# EAGLE design untitled (EAGLE 6.1)
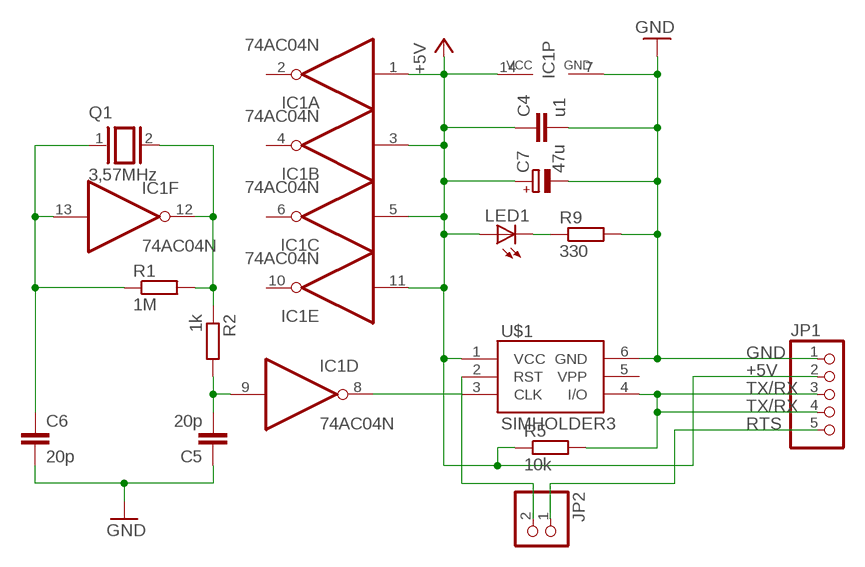
[diagram p0: schematic, sheet 1]

## Parts
C4  u1  C-EU025-025X050  [C025-025X050]
C5  20p  C-EU025-025X050  [C025-025X050]
C6  20p  C-EU025-025X050  [C025-025X050]
C7  47u  CPOL-EUE2,5-6E  [E2,5-6E]
IC1  74AC04N  [DIL14]
JP1  PINHD-1X5/90  [1X05/90]
JP2  PINHD-1X2  [1X02]
LED1  LED3MM  [LED3MM]
Q1  3,57MHz  XTAL/S  [QS]
R1  1M  R-EU_0207/2V  [0207/2V]
R2  1k  R-EU_0207/2V  [0207/2V]
R5  10k  R-EU_0207/2V  [0207/2V]
R9  330  R-EU_0207/2V  [0207/2V]
U$1  SIMHOLDER3  [SIMHOLDER3]

## Nets
+5V: C4.1 C7.+ IC1.1(A:I) IC1.3(B:I) IC1.5(C:I) IC1.11(E:I) IC1.14(P:VCC) JP1.2 LED1.A R5.1 U$1.1(VCC)
GND: C4.2 C5.1 C6.2 C7.- IC1.7(P:GND) JP1.1 R9.2 U$1.6(GND)
N$1: C5.2 IC1.9(D:I) R2.2
N$2: C6.1 IC1.13(F:I) Q1.1 R1.1
N$3: LED1.K(C) R9.1
N$4: IC1.8(D:O) U$1.3(CLK)
N$6: IC1.12(F:O) Q1.2 R1.2 R2.1
N$7: JP2.2 U$1.2(RST)
RTS: JP1.5 JP2.1
TX/RX: JP1.3 JP1.4 R5.2 U$1.4(I/O)
Unconnected: IC1.2(A:O) IC1.4(B:O) IC1.6(C:O) IC1.10(E:O) U$1.5(VPP)

## Library data of the parts
C4-C6 = rcl:C-EU: CAPACITOR, European symbol
C7 = rcl:CPOL-EU: POLARIZED CAPACITOR, European symbol
IC1 = 74xx-eu:74*04: Hex INVERTER
JP1 = pinhead:PINHD-1X5: PIN HEADER
JP2 = pinhead:PINHD-1X2: PIN HEADER
LED1 = led:LED: LED OSRAM: - CHIPLED LG R971, LG N971, LY N971, LG Q971, LY Q971, LO R971, LY R971 LH N974, LH R974 LS Q976, LO Q976, LY Q976 LO Q996 - Hyper CHIPLED LW Q18S LB Q993, LB Q99A, LB R99A - SideLED LS A670, LO A670, LY A670, LG A670, LP A670 LB A673, LV A673, LT A673, LW A673 LH A674 LY A675 LS A676, LA A676, LO A676, LY A676, LW A676 LS A679, LY A679, LG A679 - Hyper Micro SIDELED® LS Y876, LA Y876, LO Y876, LY Y876 LT Y87S - SmartLED LW L88C, LW L88S LB L89C, LB L89S, LG L890 LS L89K, LO L89K, LY L89K LS L896, LA L896, LO L896, LY L896 - TOPLED LS T670, LO T670, LY T670, LG T670, LP T670 LSG T670, LSP T670, LSY T670, LOP T670, LYG T670 LG T671, LOG T671, LSG T671 LB T673, LV T673, LT T673, LW T673 LH T674 LS T676, LA T676, LO T676, LY T676, LB T676, LH T676, LSB T676, LW T676 LB T67C, LV T67C, LT T67C, LS T67K, LO T67K, LY T67K, LW E67C LS E67B, LA E67B, LO E67B, LY E67B, LB E67C, LV E67C, LT E67C LW T67C LS T679, LY T679, LG T679 LS T770, LO T770, LY T770, LG T770, LP T770 LB T773, LV T773, LT T773, LW T773 LH T774 LS E675, LA E675, LY E675, LS T675 LS T776, LA T776, LO T776, LY T776, LB T776 LHGB T686 LT T68C, LB T68C - Hyper Mini TOPLED® LB M676 - Mini TOPLED Santana® LG M470 LS M47K, LO M47K, LY M47K Source: http://www.osram.convergy.de LUXEON: - LUMILED® LXK2-PW12-R00, LXK2-PW12-S00, LXK2-PW14-U00, LXK2-PW14-V00 LXK2-PM12-R00, LXK2-PM12-S00, LXK2-PM14-U00 LXK2-PE12-Q00, LXK2-PE12-R00, LXK2-PE12-S00, LXK2-PE14-T00, LXK2-PE14-U00 LXK2-PB12-K00, LXK2-PB12-L00, LXK2-PB12-M00, LXK2-PB14-N00, LXK2-PB14-P00, LXK2-PB14-Q00 LXK2-PR12-L00, LXK2-PR12-M00, LXK2-PR14-Q00, LXK2-PR14-R00 LXK2-PD12-Q00, LXK2-PD12-R00, LXK2-PD12-S00 LXK2-PH12-R00, LXK2-PH12-S00 LXK2-PL12-P00, LXK2-PL12-Q00, LXK2-PL12-R00 Source: www.luxeon.com KINGBRIGHT: KA-3528ASYC Source: www.kingbright.com
Q1 = special:XTAL/S: CRYSTAL
R1 R2 R5 R9 = rcl:R-EU_: RESISTOR, European symbol
U$1 = SparkFun-Connectors:SIMHOLDER3: Alternate SIM card socket

## Board
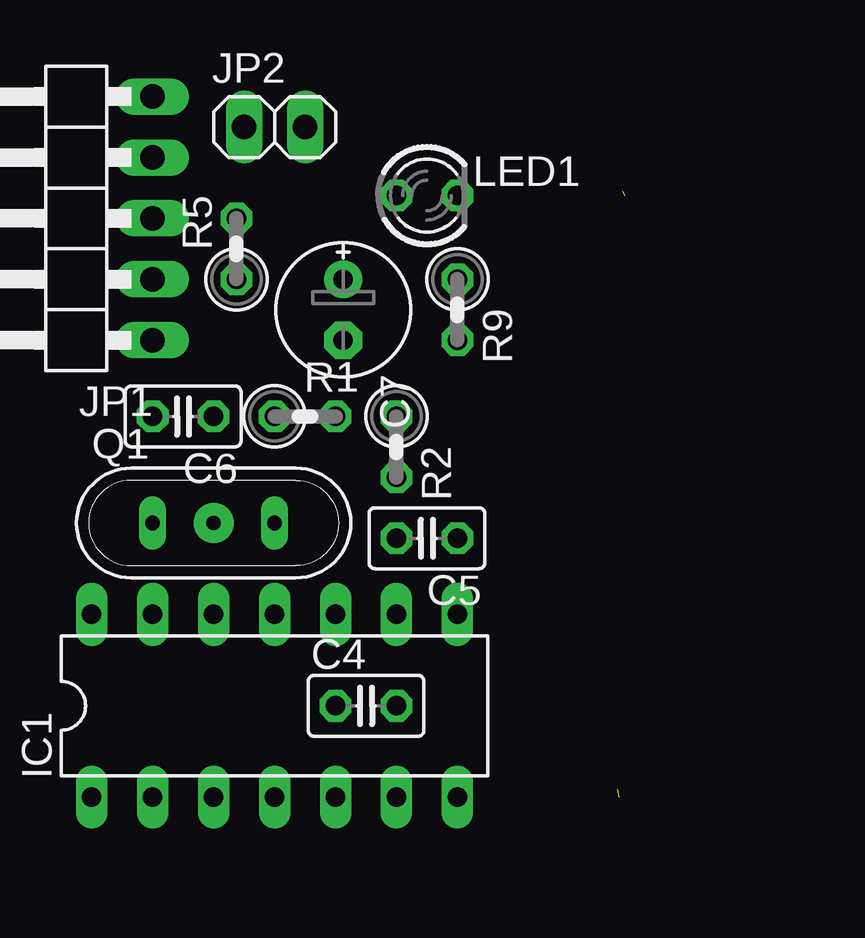
[diagram p1: board, top side]
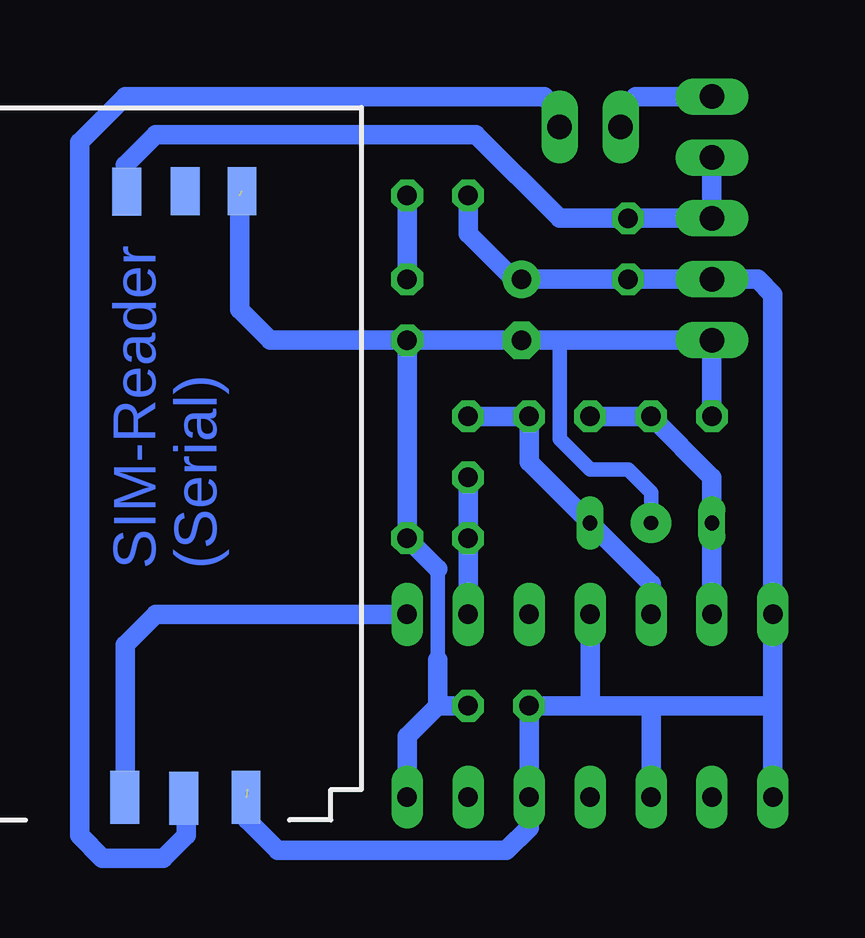
[diagram p2: board, bottom side, seen from below]

No outline drawn. Coordinates in mm, seen from the top.
Copper layers (1*16): Top 0.035mm / dielectric 1.5mm / Bottom 0.035mm
Design rules: minimum track width 10mil, minimum drill 24mil, track to track 8mil, track to pad 8mil, pad to pad 8mil, via to via 8mil, smd to smd 8mil, copper to edge 40mil, drill to drill 8mil, minimum pad ring 10mil, minimum via ring 8mil, stop-mask expansion 4mil, vias tented up to drill 0mil, thermal gap 10mil

### Footprints (pad centres in the part's own frame; a part is rotated, then mirrored left to right if it is on the bottom)
C025-025X050 = drill 0.813 octagon: 1 -1.27,0; 2 1.27,0
E2,5-6E = drill 0.813 pad 1.575: + -1.27,0 | drill 0.813 pad 1.575 octagon: - 1.27,0
DIL14 = drill 0.813 long: 1 -7.62,-3.81; 2 -5.08,-3.81; 3 -2.54,-3.81; 4 0,-3.81; 5 2.54,-3.81; 6 5.08,-3.81; 7 7.62,-3.81; 8 7.62,3.81; 9 5.08,3.81; 10 2.54,3.81; 11 0,3.81; 12 -2.54,3.81; 13 -5.08,3.81; 14 -7.62,3.81
1X05/90 = drill 1.016 long: 1 -5.08,-3.81; 2 -2.54,-3.81; 3 0,-3.81; 4 2.54,-3.81; 5 5.08,-3.81
1X02 = drill 1.016 long: 1 -1.27,0; 2 1.27,0
LED3MM = drill 0.813 octagon: A -1.27,0; K 1.27,0
QS = drill 0.61 long: 1 -2.54,0; 2 2.54,0
0207/2V = drill 0.813 octagon: 1 -1.27,0; 2 1.27,0
SIMHOLDER3 = smd 2.2 x 1.2: 1 0.95,4.81; 2 0.91,7.41; 3 0.95,9.86 | smd 2 x 1.2: 4 26.2,9.78; 5 26.22,7.34; 6 26.22,4.98

### Placement (x,y rotation side)
C4  24.45,12.7 0 top
C5  26.99,19.68 180 top
C6  16.83,24.77 180 top
C7  23.5,29.21 270 top
IC1  20.64,12.7 0 top
JP1  11.75,33.02 90 top
JP2  20.64,36.83 0 top
LED1  26.99,33.97 0 top
Q1  18.1,20.32 0 top
R1  21.91,24.77 0 top
R2  25.72,23.5 270 top
R5  19.05,31.75 90 top
R9  28.26,29.21 270 top
U$1  30.16,7.94 90 bottom

### Tracks (layer width: path | path; a pad name or v marks a point on that pad's centre or on a via)
+5V  (1 unrouted)
  Bottom 0.813: IC1.14 13.02,16.83 | IC1.14 13.02,12.7 | 13.02,12.7 IC1.1 | IC1.3 18.1,12.7 | 18.1,12.7 13.02,12.7 | 18.1,12.7 20.64,12.7 | IC1.11 20.64,12.7 | 20.64,12.7 C4.1 IC1.5 23.18,7.62 24.13,6.67 33.66,6.67 34.92,7.94 34.92,9.21 | IC1.14 13.02,29.84 13.65,30.48 JP1.2 R5.1 C7.+ 23.81,30.48 25.72,32.38 LED1.A
GND  (1 unrouted)
  Bottom 0.61: 26.99,18.41 26.99,14.61
  Bottom 0.813: 26.99,18.41 C5.1 R9.2 | 26.99,12.7 28.26,11.43 IC1.7 | 26.99,12.7 C4.2 | C6.2 JP1.1 C7.- R9.2 | R9.2 33.97,27.94 35.24,29.21 35.24,33.97 | 26.99,14.61 26.99,12.7
N$1
  Bottom 0.813: IC1.9 C5.2 R2.2
N$2
  Bottom 0.813: IC1.13 Q1.1 15.56,22.23 C6.1 R1.1
N$3
  Bottom 0.813: LED1.K R9.1
N$4
  Bottom 0.813: IC1.8 38.73,16.51 40.01,15.24 40.01,8.9 U$1.3
N$6
  Bottom 0.813: IC1.12 18.1,17.78 Q1.2 23.18,22.86 R1.2 R2.1
N$7
  Bottom 0.813: U$1.2 37.47,8.74 37.47,7.3 38.42,6.35 40.96,6.35 41.91,7.3 41.91,36.2 40.01,38.1 22.54,38.1 21.91,37.47 JP2.2
N$9  (via drill 0.6 pad 1.68)
  Bottom 0.61: 21.91,27.62 21.91,23.81 20.64,22.54 19.05,22.54 18.1,21.59 v18.1,20.32
RTS
  Bottom 0.813: JP1.5 18.73,38.1 19.37,37.47 JP2.1
TX/RX
  Bottom 0.813: JP1.4 JP1.3 R5.2 21.91,33.02 25.4,36.51 38.73,36.51 40.01,35.24 40.01,34.2 U$1.4

### Text on the board
Bottom: (Serial) | SIM-Reader